# EAGLE schematic schematic (EAGLE 8.2.0)
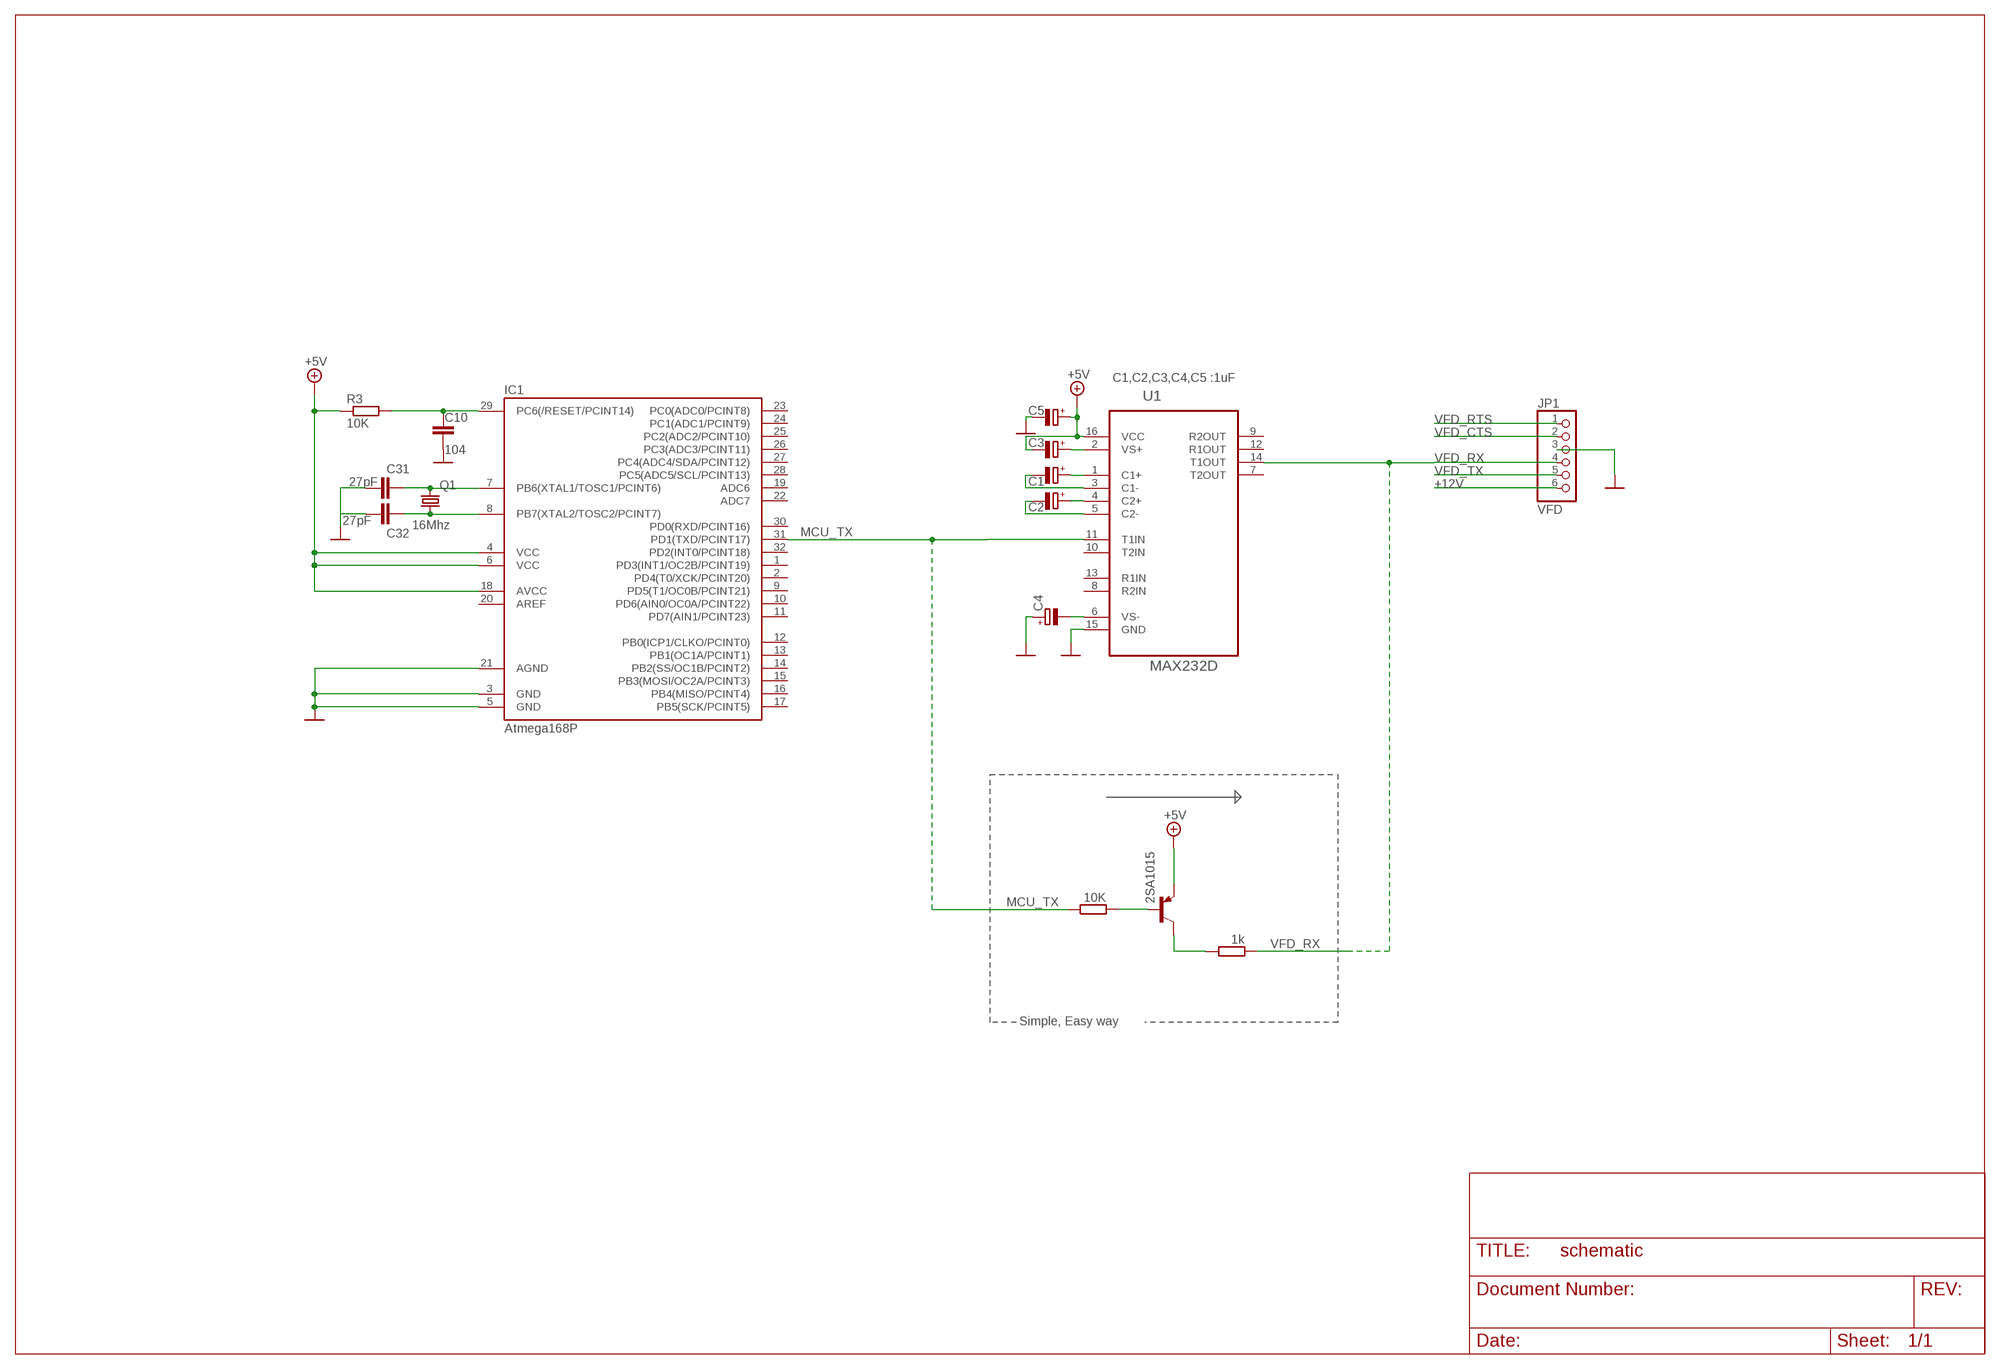
[diagram p0: schematic, sheet 1]

## Parts
C1  CPOL-EUE1.8-4  [E1,8-4]
C2  CPOL-EUE1.8-4  [E1,8-4]
C3  CPOL-EUE1.8-4  [E1,8-4]
C4  CPOL-EUE1.8-4  [E1,8-4]
C5  CPOL-EUE1.8-4  [E1,8-4]
C10  104  C-EU025-025X050  [C025-025X050]
C31  27pF  C-EU025-025X050  [C025-025X050]
C32  27pF  C-EU025-025X050  [C025-025X050]
IC1  Atmega168P  MEGA48/88/168-AU  [TQFP32-08]
JP1  VFD  HEADER-1X676MIL  [1X06_ROUND_76]
Q1  16Mhz  CRYSTALHC49U-V  [HC49U-V]
R1  1k  R-EU_0204/7  [0204/7]
R2  10K  R-EU_0204/7  [0204/7]
R3  10K  R-EU_0204/7  [0204/7]
T2  2SA1015  -PNP-TO92-ECB  [TO92-ECB]
U1  MAX232D  [SOIC127P600X175-16N]

## Nets
+5V: C3.- C5.+ IC1.4(VCC) IC1.6(VCC) IC1.18(AVCC) R3.1 T2.E U1.16(VCC)
+12V: JP1.6
GND: C4.+ C5.- C10.1 C32.2 IC1.3(GND) IC1.5(GND) IC1.21(AGND) JP1.3 U1.15(GND)
MCU_TX: IC1.31(PD1(TXD/PCINT17)) R2.1 U1.11(T1IN)
N$1: C32.1 IC1.8(PB7(XTAL2/TOSC2/PCINT7)) Q1.1
N$2: R2.2 T2.B
N$3: C31.2
N$4: C31.1 IC1.7(PB6(XTAL1/TOSC1/PCINT6)) Q1.2
N$5: C1.+ U1.1(C1+)
N$6: C1.- U1.3(C1-)
N$7: C2.+ U1.4(C2+)
N$8: C2.- U1.5(C2-)
N$9: C3.+ U1.2(VS+)
N$10: C4.- U1.6(VS-)
N$11: R1.1 T2.C
RESET: C10.2 IC1.29(PC6(/RESET/PCINT14)) R3.2
VFD_CTS: JP1.2
VFD_RTS: JP1.1
VFD_RX: JP1.4 R1.2 U1.14(T1OUT)
VFD_TX: JP1.5
Unconnected: IC1.1(PD3(INT1/OC2B/PCINT19)) IC1.2(PD4(T0/XCK/PCINT20)) IC1.9(PD5(T1/OC0B/PCINT21)) IC1.10(PD6(AIN0/OC0A/PCINT22)) IC1.11(PD7(AIN1/PCINT23)) IC1.12(PB0(ICP1/CLKO/PCINT0)) IC1.13(PB1(OC1A/PCINT1)) IC1.14(PB2(SS/OC1B/PCINT2)) IC1.15(PB3(MOSI/OC2A/PCINT3)) IC1.16(PB4(MISO/PCINT4)) IC1.17(PB5(SCK/PCINT5)) IC1.19(ADC6) IC1.20(AREF) IC1.22(ADC7) IC1.23(PC0(ADC0/PCINT8)) IC1.24(PC1(ADC1/PCINT9)) IC1.25(PC2(ADC2/PCINT10)) IC1.26(PC3(ADC3/PCINT11)) IC1.27(PC4(ADC4/SDA/PCINT12)) IC1.28(PC5(ADC5/SCL/PCINT13)) IC1.30(PD0(RXD/PCINT16)) IC1.32(PD2(INT0/PCINT18)) U1.7(T2OUT) U1.8(R2IN) U1.9(R2OUT) U1.10(T2IN) U1.12(R1OUT) U1.13(R1IN)

## Notes on the sheet
- C1,C2,C3,C4,C5 :1uF
- Simple, Easy way

## Library data of the parts
C1-C5 = rcl:CPOL-EU: POLARIZED CAPACITOR, European symbol
C10 C31 C32 = rcl:C-EU: CAPACITOR, European symbol
IC1 = atmel2:MEGA48/88/168
JP1 = 0microbuilder:HEADER-1X6: PIN HEADER
Q1 = crystal:CRYSTAL: CRYSTAL; OC_FARNELL: 1666969; OC_NEWARK: unknown
R1-R3 = rcl:R-EU_: RESISTOR, European symbol
T2 = transistor-neu-to92:*-PNP-: PNP Transistror
U1 = 0Texas Instruments_By_element14_Batch_1:MAX232D: DUAL EIA-232 DRIVERS/RECEIVERS; MPN: MAX232D; OC_FARNELL: 1470443; OC_NEWARK: 35K4719; PACKAGE: SOIC-16; SUPPLIER: Texas Instruments

## Net classes
1 gnd: width 0.762 mm